# Altium project Energy Harvester 2.0.PrjPCB
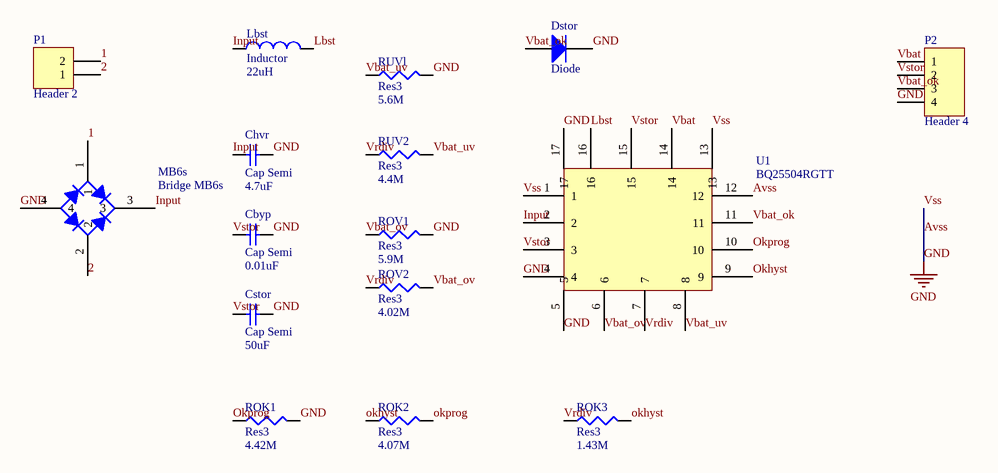
[diagram p0: piezo energy harvesting 4.0.SchDoc]
1 sheet, 16 parts. Net scope: global (net labels, ports and power ports of the same name join across sheets).
Board file: BQ25504 piezo energy harvesting.PcbDoc

## Sheet piezo energy harvesting 4.0.SchDoc
size A4

### Parts
Cbyp  Cap Semi  value 0.01uF  [0402]
Chvr  Cap Semi  value 4.7uF  [0402]
Cstor  Cap Semi  value 50uF  [0402]
Dstor  Diode  [0402]
Lbst  Inductor  value 22uH  [0402]
MB6s  Bridge MB6s  [MB6S]
P1  Header 2  [HDR1X2]
P2  Header 4  [HDR1X4]
ROK1  Res3  value 4.42M  [0402]
ROK2  Res3  value 4.07M  [0402]
ROK3  Res3  value 1.43M  [0402]
ROV1  Res3  value 5.9M  [0402]
ROV2  Res3  value 4.02M  [0402]
RUV2  Res3  value 4.4M  [0402]
RUVl  Res3  value 5.6M  [0402]
U1  BQ25504RGTT  [BQ25504rgtt]

### Nets
Avss: Cbyp.2 Chvr.2 Cstor.2 Dstor.2(K) MB6s.4 P2.4 ROK1.2 ROV1.2 RUVl.2 U1.1 U1.4 U1.5 U1.12 U1.13 U1.17  [also labelled GND, Vss]
1: MB6s.1 P1.2
2: MB6s.2 P1.1
Input: Chvr.1 Lbst.1 MB6s.3 U1.2
Lbst: Lbst.2 U1.16
Okhyst: ROK2.1 ROK3.2 U1.9
Okprog: ROK1.1 ROK2.2 U1.10
Vbat: P2.1 U1.14
Vbat_ok: Dstor.1(A) P2.3 U1.11
Vbat_ov: ROV1.1 ROV2.2 U1.6
Vbat_uv: RUV2.2 RUVl.1 U1.8
Vrdiv: ROK3.1 ROV2.1 RUV2.1 U1.7
Vstor: Cbyp.1 Cstor.1 P2.2 U1.3 U1.15

### Library data of the parts
Cbyp Chvr Cstor = Cap Semi: Capacitor (Semiconductor SIM Model); Published: 8-Jun-2000; LatestRevisionDate: 29-May-2009; LatestRevisionNote: IPC-7351 Footprint Added.; PackageReference: C1206; Publisher: Altium Limited; PackageDescription: Chip Capacitor
Dstor = Diode: Default Diode; Published: 8-Jun-2000; LatestRevisionDate: 17-Jul-2002; LatestRevisionNote: Re-released for DXP Platform.; PackageVersion: Sep-1996; PackageReference: SMC; Publisher: Altium Limited; PackageDescription: DO-214-AB/SMC; 2 C-Bend Leads; Body 7.9 x 5.9 mm, inc. leads (LxW); Code_JEDEC: DO-214-AB
Lbst = Inductor: Code_IEC: 1005; Published: 8-Jun-2000; LatestRevisionDate: 29-May-2009; LatestRevisionNote: IPC-7351 Footprint Added.; PackageReference: 0402-A; Publisher: Altium Limited; PackageDescription: Chip Inductor; Code_JEITA: 0402
P1 = Header 2: Header, 2-Pin; LatestRevisionDate: 17-Jul-2002; LatestRevisionNote: Re-released for DXP Platform.; Publisher: Altium Limited
P2 = Header 4: Header, 4-Pin; LatestRevisionDate: 17-Jul-2002; LatestRevisionNote: Re-released for DXP Platform.; Publisher: Altium Limited
ROK1-ROK3 ROV1 ROV2 RUV2 RUVl = Res3: Resistor; Published: 8-Jun-2000; LatestRevisionDate: 29-May-2009; LatestRevisionNote: IPC-7351 Footprint Added.; PackageReference: J1-0603; Publisher: Altium Limited; PackageDescription: Chip Resistor